# EAGLE schematic untitled (EAGLE 6.5.0)
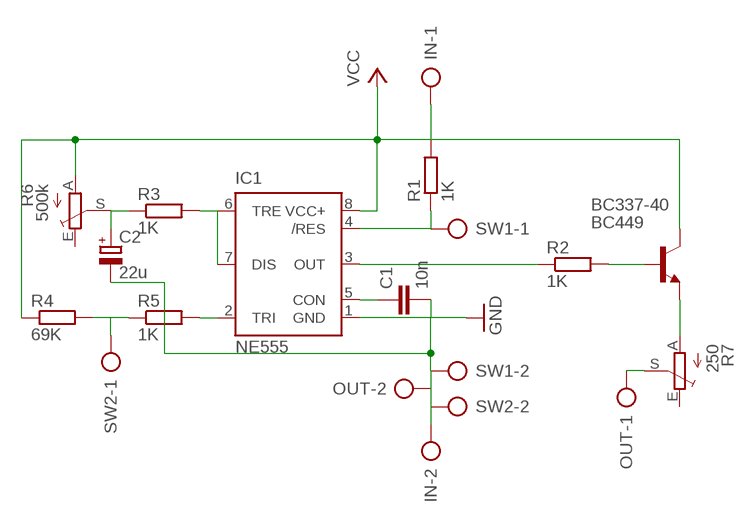
[diagram p0: schematic, sheet 1]

## Parts
BC337-40  BC449  [TO92-EBC]
C1  10n  C-EU050-024X044  [C050-024X044]
C2  22u  CPOL-EUE2.5-5  [E2,5-5]
IC1  NE555  [DIL-08]
IN  AK500/2  [AK500/2]
OUT  AK500/2  [AK500/2]
R1  1K  R-EU_0204/7  [0204/7]
R2  1K  R-EU_0204/7  [0204/7]
R3  1K  R-EU_0204/7  [0204/7]
R4  69K  R-EU_0204/7  [0204/7]
R5  1K  R-EU_0204/7  [0204/7]
R6  500k  TRIM_EU-CA6V  [CA6V]
R7  250  TRIM_EU-CA6V  [CA6V]
SW1  AK500/2  [AK500/2]
SW2  AK500/2  [AK500/2]

## Nets
GND: C1.2 C2.- IC1.1(GND) IN.2 OUT.2 SW1.2 SW2.2
N$2: C2.+ R3.1 R6.S
N$3: IC1.6(TRE) IC1.7(DIS) R3.2
N$4: IC1.4(/RES) R1.1 SW1.1
N$5: BC337-40.B R2.2
N$6: BC337-40.E R7.A
N$7: OUT.1 R7.S
N$9: IC1.3(OUT) R2.1
N$10: C1.1 IC1.5(CON)
N$11: IC1.2(TRI) R5.2
N$12: R4.2 R5.1 SW2.1
VCC: BC337-40.C IC1.8(VCC+) IN.1 R1.2 R4.1 R6.A
Unconnected: R6.E R7.E

## Library data of the parts
BC337-40 = transistor-npn:BC449*: NPN Transistor
C1 = rcl:C-EU: CAPACITOR, European symbol
C2 = rcl:CPOL-EU: POLARIZED CAPACITOR, European symbol
IC1 = st-microelectronics:NE555: General purpose bipolar Timer; MF: Arrow Electronics; MPN: NE555N; OC_FARNELL: 1467742; OC_NEWARK: 89K1486
IN OUT SW1 SW2 = con-ptr500:AK500/2: CONNECTOR; OC_FARNELL: unknown; OC_NEWARK: unknown
R1-R5 = resistor:R-EU_: RESISTOR, European symbol
R6 R7 = pot:TRIM_EU-: POTENTIOMETER